# EasyEDA Pro project Tracer-1.1.epro

# Schematic Schematic1.1
Board Name: Tracer-1.0; Create Date: 2025-08-11; Page Name: P1; Project Name: Tracer; Schematic Name: Schematic1.0; Update Date: 2025-08-10; Company: EasyEDA.com; Page Size: A4; Version: V1.0
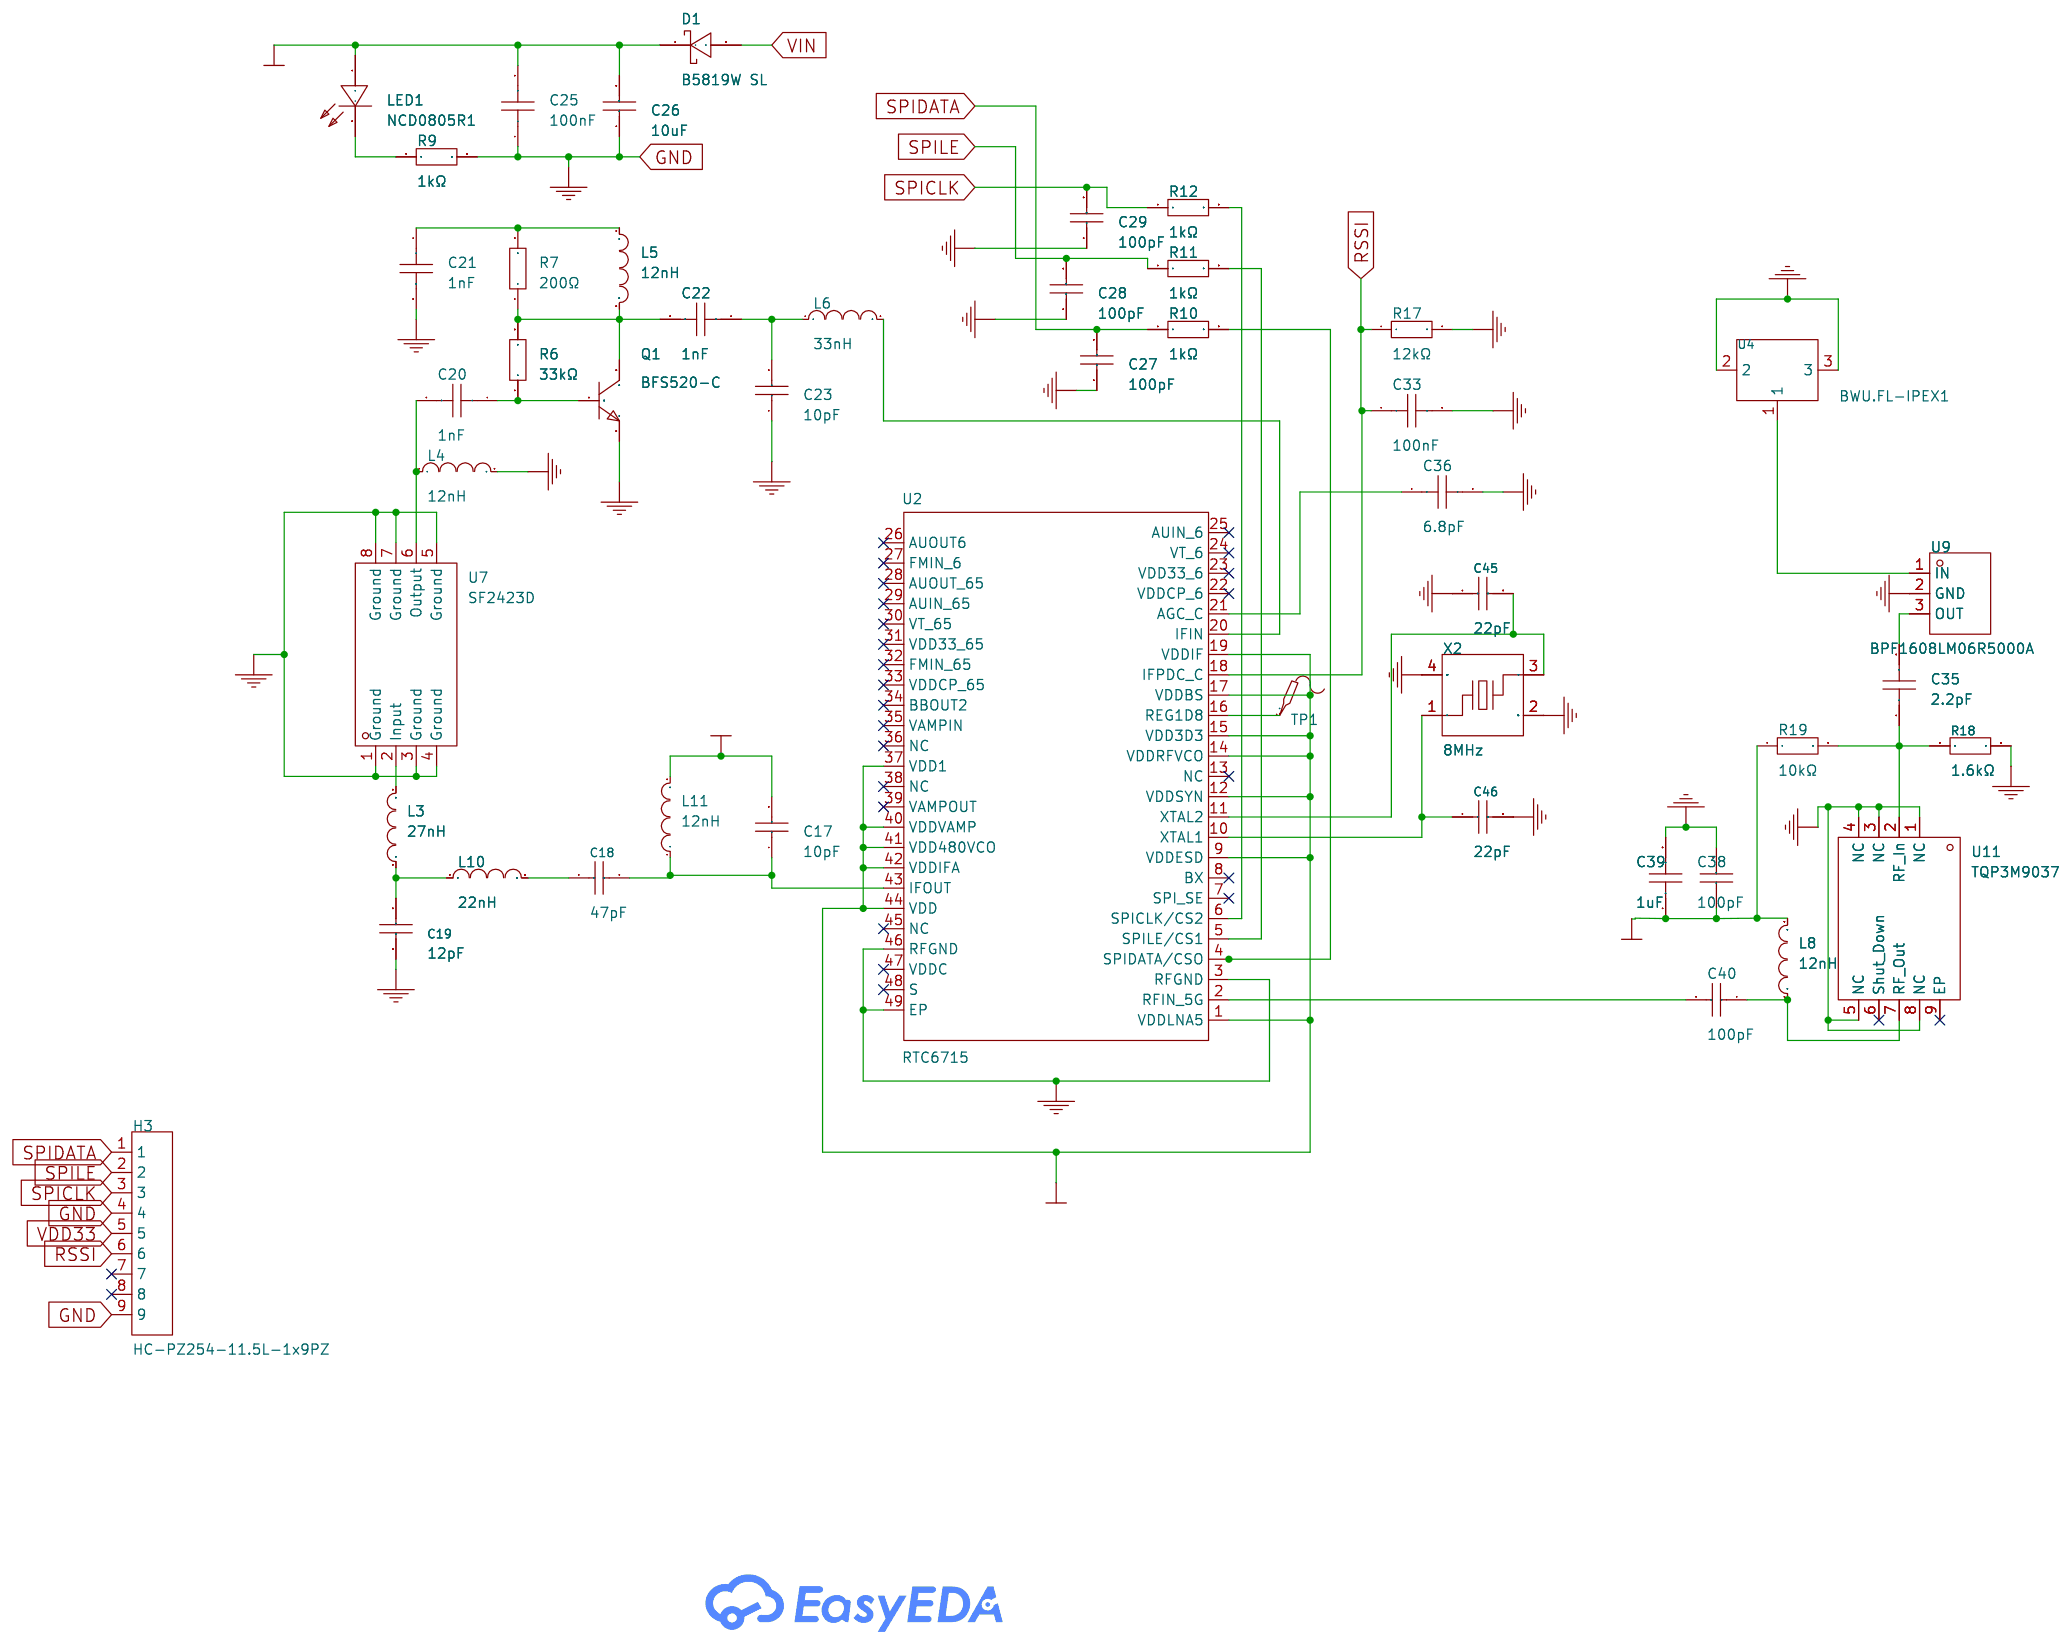
[diagram p0: schematic sheet]

## Parts
C17  10pF  [C0402]
C18  47pF  [C0402]
C19  12pF  [C0402]
C20  1nF  [C0402]
C21  1nF  [C0402]
C22  1nF  [C0402]
C23  10pF  [C0402]
C25  100nF  [C0402]
C26  10uF  [C0402]
C27  100pF  [C0402]
C28  100pF  [C0402]
C29  100pF  [C0402]
C33  100nF  [C0402]
C35  2.2pF  [C0402]
C36  6.8pF  [C0402]
C38  100pF  [C0402]
C39  1uF  [C0402]
C40  100pF  [C0402]
C45  22pF  [C0402]
C46  22pF  [C0402]
D1  B5819W SL  [SOD-123_L2.7-W1.6-LS3.7-RD-1]  (no BOM)
H3  HC-PZ254-11.5L-1x9PZ  [HDR-TH_9P-P2.54-V-M]
L3  27nH  [L0402-RD]
L4  12nH  [L0402]
L5  12nH  [L0402]
L6  33nH  [L0402]
L8  12nH  [L0402]
L10  22nH  [L0402]
L11  12nH  [L0402]
LED1  NCD0805R1  [LED0805-R-RD]
Q1  BFS520-C  [SOT-323-3_L2.0-W1.3-P1.30-LS2.3-BR]
R6  33kΩ  [R0402]
R7  200Ω  [R0402]
R9  1kΩ  [R0402]
R10  1kΩ  [R0402]
R11  1kΩ  [R0402]
R12  1kΩ  [R0402]
R17  12kΩ  [R0402]
R18  1.6kΩ  [R0402]
R19  10kΩ  [R0402]
TP1  -  [Test-Point-0.5mm]
U2  RTC6715  [QFN-48_L7.0-W7.0-P0.50-BL-EP5.6]
U4  BWU.FL-IPEX1  [IPEX-SMD_BWIPX-1-001E]
U7  SF2423D  [FILTER-SMD_8P-L3.8-W3.8-P1.27-BL]
U9  BPF1608LM06R5000A  [FILTER-SMD_3P-L1.6-W0.8-L]
U11  TQP3M9037  [DFN-8_L2.0-W2.0-P0.50-BL-EP]
X2  8MHz  [CRYSTAL-SMD_4P-L3.2-W2.5-BL]

## Library data of the parts
C17 = CC0402JRNPO9BN100: Capacitance: Tolerance:±5% Tolerance:±5% Voltage Rated: Temperature Coefficient:; LCSC Part Name: 10pF ±5% 50V; Supplier Part: C106199; Manufacturer: YAGEO(国巨); Supplier Footprint: 0402; JLCPCB Part Class: Extended Part; Datasheet: https://atta.szlcsc.com/upload/public/pdf/source/20181008/C309499_21CC21451B82C39E3D92150FD6B30293.pdf; Supplier: LCSC; Tolerance: ±5%
C18 = CC0402JRNPO9BN470: Capacitance: Tolerance:±5% Tolerance:±5% Voltage Rated: Temperature Coefficient:; LCSC Part Name: 47pF ±5% 50V; Supplier Part: C60137; Manufacturer: YAGEO(国巨); Supplier Footprint: 0402; JLCPCB Part Class: Extended Part; Datasheet: https://atta.szlcsc.com/upload/public/pdf/source/20170505/1493957838062.pdf; Supplier: LCSC; Tolerance: ±5%
C19 = GRM1555C1H120JA01D: Capacitance: Tolerance:±5% Tolerance:±5% Voltage Rated: Temperature Coefficient:; LCSC Part Name: 12pF ±5% 50V; Supplier Part: C76948; Manufacturer: muRata(村田); Supplier Footprint: 0402; JLCPCB Part Class: Extended Part; Datasheet: https://atta.szlcsc.com/upload/public/pdf/source/20180307/C76948_15204091175261407736.pdf; Supplier: LCSC; Tolerance: ±5%
C20-C22 = GRM155R71H102KA01D: Capacitance: Tolerance:±10% Tolerance:±10% Voltage Rated: Temperature Coefficient:; LCSC Part Name: 1nF ±10% 50V; Supplier Part: C77018; Manufacturer: muRata(村田); Supplier Footprint: 0402; JLCPCB Part Class: Extended Part; Datasheet: https://atta.szlcsc.com/upload/public/pdf/source/20180326/C77018_71D0653F0B6E6646EFFB4BBD1FDBEE7C.pdf; Supplier: LCSC; Tolerance: ±10%
C23 = GRM1555C1H100JA01D: Capacitance: Tolerance:±5% Tolerance:±5% Voltage Rated: Temperature Coefficient:; LCSC Part Name: 10pF ±5% 50V; Supplier Part: C76946; Manufacturer: muRata(村田); Supplier Footprint: 0402; JLCPCB Part Class: Extended Part; Datasheet: https://atta.szlcsc.com/upload/public/pdf/source/20180307/C76946_15204091154331407734.pdf; Supplier: LCSC; Tolerance: ±5%
C25 C33 = CL05B104KO5NNNC: Capacitance: Tolerance:±10% Tolerance:±10% Voltage Rated: Temperature Coefficient:; LCSC Part Name: 100nF ±10% 16V; Supplier Part: C1525; Manufacturer: SAMSUNG(三星); Supplier Footprint: 0402; JLCPCB Part Class: Basic Part; Datasheet: https://atta.szlcsc.com/upload/public/pdf/source/20160218/1457707763339.pdf; Supplier: LCSC; Tolerance: ±10%
C26 = GRM155R60J106ME44D: Capacitance: Tolerance:±20% Tolerance:±20% Voltage Rated: Temperature Coefficient:; LCSC Part Name: 10uF ±20% 6.3V; Supplier Part: C76991; Manufacturer: muRata(村田); Supplier Footprint: 0402; JLCPCB Part Class: Extended Part; Datasheet: https://atta.szlcsc.com/upload/public/pdf/source/20200305/C490387_23319AE8C154DEB24C505E6C82A8106A.pdf; Supplier: LCSC; Tolerance: ±20%
C27-C29 C38 C40 = GRM1555C1H101JA01D: Capacitance: Tolerance:±5% Tolerance:±5% Voltage Rated: Temperature Coefficient:; LCSC Part Name: 100pF ±5% 50V; Supplier Part: C77177; Manufacturer: muRata(村田); Supplier Footprint: 0402; JLCPCB Part Class: Extended Part; Datasheet: https://atta.szlcsc.com/upload/public/pdf/source/20161108/1478586482814.pdf; Supplier: LCSC; Tolerance: ±5%
C35 = GJM1555C1H2R2BB01D: Capacitance: Voltage Rating: Temperature Coefficient:; LCSC Part Name: ±0.1pF 2.2pF 50V; Supplier Part: C88886; Manufacturer: muRata(村田); Supplier Footprint: 0402; JLCPCB Part Class: Extended Part; Datasheet: https://atta.szlcsc.com/upload/public/pdf/source/20241220/D0AFAF126C1929700C0BCD7972400352.pdf; Supplier: LCSC
C36 = CC0402CRNPO9BN6R8: Capacitance: Voltage Rated: Temperature Coefficient:; LCSC Part Name: 6.8pF 50V ±0.25pF; Supplier Part: C189470; Manufacturer: YAGEO(国巨); Supplier Footprint: 0402; JLCPCB Part Class: Extended Part; Datasheet: https://atta.szlcsc.com/upload/public/pdf/source/20181008/C309499_21CC21451B82C39E3D92150FD6B30293.pdf; Supplier: LCSC
C39 = CL05A105KA5NQNC: Capacitance: Tolerance:±10% Tolerance:±10% Voltage Rated: Temperature Coefficient:; LCSC Part Name: 1uF ±10% 25V; Supplier Part: C52923; Manufacturer: SAMSUNG(三星); Supplier Footprint: 0402; JLCPCB Part Class: Basic Part; Datasheet: https://atta.szlcsc.com/upload/public/pdf/source/20160218/1457707763339.pdf; Supplier: LCSC; Tolerance: ±10%
C45 C46 = CC0402JRNPO9BN220: Capacitance: Tolerance:±5% Tolerance:±5% Voltage Rated: Temperature Coefficient:; LCSC Part Name: 22pF ±5% 50V; Supplier Part: C106203; Manufacturer: YAGEO(国巨); Supplier Footprint: 0402; JLCPCB Part Class: Extended Part; Datasheet: https://atta.szlcsc.com/upload/public/pdf/source/20170505/1493957838062.pdf; Supplier: LCSC; Tolerance: ±5%
D1 = B5819W SL: Forward Voltage (Vf@If):600mV@1A Reverse Voltage (Vr):40V Rectified Current:1A; LCSC Part Name: 电压:40V 电流:1A; Supplier Part: C8598; Manufacturer: CJ(江苏长电/长晶); Supplier Footprint: SOD-123; JLCPCB Part Class: Basic Part; Datasheet: https://atta.szlcsc.com/upload/public/pdf/source/20171228/C164911_15144413243851213914.pdf; Supplier: LCSC; Forward Voltage (Vf@If): 600mV@1A; Reverse Voltage (Vr): 40V; Rectified Current: 1A
H3 = HC-PZ254-11.5L-1x9PZ: Pin Structure:1x9P Pitch:2.54mm Row Spacing:- Circluar Pins/Square Pins:Policy Mounting Type:Straight Number of Rows:Single Row Number of Pins:9P Current Rating:3A Voltage Rating (Max):- Length of Mating Pin:6mm Insulation Height:2.5mm Length of End Conne; LCSC Part Name: 1x9P 间距:2.54mm 方针 直插; Supplier Part: C27985193; Manufacturer: HC(虹成电子); Supplier Footprint: 插件,P=2.54mm; JLCPCB Part Class: Extended Part; Datasheet: https://atta.szlcsc.com/upload/public/pdf/source/20250106/3C3F1947CD1C0315AE43406BAF0BB9D7.pdf; Supplier: LCSC; Pin Structure: 1x9P; Pitch: 2.54mm; Circluar Pins/Square Pins: Policy; Mounting Type: Straight; Number of Rows: Single Row; Number of Pins: 9P; Current Rating: 3A; Length of Mating Pin: 6mm; Insulation Height: 2.5mm; Length of End Connection Pin: 3mm; Contact Material: Brass; Contact Plating: Gold; Operating Temperature: -40℃~+105℃; Color: Black
L3 = LQG15HS27NJ02D: Inductance: Tolerance:±5% Tolerance:±5% Rated Current: Saturation Current (Isat):- DC Resistance (DCR): Q @ Freq:8@100MHz Frequency - Self Resonant: Ratings:; LCSC Part Name: 27nH ±5%; Supplier Part: C12669; Manufacturer: muRata(村田); Supplier Footprint: 0402; JLCPCB Part Class: Extended Part; Datasheet: https://atta.szlcsc.com/upload/public/pdf/source/20170810/C86059_1502335402466879997.pdf; Supplier: LCSC; Tolerance: ±5%; Q @ Freq: 8@100MHz
L4 L5 L8 L11 = LQW15AN12NG00D: Inductance: Tolerance:±2% Tolerance:±2% Rated Current: Saturation Current (Isat):- DC Resistance (DCR): Ratings:-; LCSC Part Name: 12nH ±2%; Supplier Part: C86128; Manufacturer: muRata(村田); Supplier Footprint: 0402; JLCPCB Part Class: Extended Part; Datasheet: https://atta.szlcsc.com/upload/public/pdf/source/20161104/1478253457680.pdf; Supplier: LCSC; Tolerance: ±2%
L6 = LQG15HS33NJ02D: Inductance: Tolerance:±5% Tolerance:±5% Rated Current: Saturation Current (Isat):- DC Resistance (DCR): Q @ Freq:8@100MHz Frequency - Self Resonant: Ratings:; LCSC Part Name: 33nH ±5%; Supplier Part: C86062; Manufacturer: muRata(村田); Supplier Footprint: 0402; JLCPCB Part Class: Extended Part; Datasheet: https://atta.szlcsc.com/upload/public/pdf/source/20180612/C185484_14F678484DDF036353DC67B6265A9221.pdf; Supplier: LCSC; Tolerance: ±5%; Q @ Freq: 8@100MHz
L10 = LQW15AN22NJ00D: Inductance: Tolerance:±5% Tolerance:±5% Rated Current: Saturation Current (Isat):- DC Resistance (DCR): Ratings:-; LCSC Part Name: 22nH ±5%; Supplier Part: C167470; Manufacturer: muRata(村田); Supplier Footprint: 0402; JLCPCB Part Class: Extended Part; Datasheet: https://atta.szlcsc.com/upload/public/pdf/source/20191016/C437364_463D6516B3BAE72B1DA0754F3D9B8308.pdf; Supplier: LCSC; Tolerance: ±5%
LED1 = NCD0805R1_C84256: Lamp Holder Type:- Emitted Color:Red Forward Voltage (VF):1.6V~2.6V Forward Voltage (VF):1.6V~2.6V Power Dissipation:65mW Forward Current:20mA Dominant Wavelength:615nm~630nm Dominant Wavelength:615nm~630nm Peak Wavelength:- Diode Configuration:独立二极管 Lens; Supplier Part: C84256; Manufacturer: 国星光电; Supplier Footprint: 0805; JLCPCB Part Class: Basic Part; Datasheet: https://atta.szlcsc.com/upload/public/pdf/source/20200820/C84256_F0A75A43B3EAD75808600A0514C76B99.pdf; Supplier: LCSC; Emitted Color: Red; Forward Voltage (VF): 1.6V~2.6V; Power Dissipation: 65mW; Forward Current: 20mA; Dominant Wavelength: 615nm~630nm; Diode Configuration: 独立二极管; Lens Color: 无色透明透镜; Luminous Intensity: 67mcd~195mcd; Viewing Angle: 130°; Operating Temperature: -30℃~+85℃
Q1 = BFS520-C: type:NPN Current - Collector(Ic): Collector - Emitter Voltage VCEO:12V Pd - Power Dissipation:150mW Transition frequency(fT):8GHz Current - Collector Cutoff:100nA Operating Temperature:150℃@(Tj) Operating Temperature:150℃@(Tj); Supplier Part: C7496541; Manufacturer: Slkor(萨科微); Supplier Footprint: SOT-323; JLCPCB Part Class: Extended Part; Datasheet: https://atta.szlcsc.com/upload/public/pdf/source/20230809/CB04839AF99A4F42C665D5FCB4C9F9C8.pdf; Supplier: LCSC; type: NPN; Collector - Emitter Voltage VCEO: 12V; Pd - Power Dissipation: 150mW; Transition frequency(fT): 8GHz; Current - Collector Cutoff: 100nA; Operating Temperature: 150℃@(Tj)
R6 = RC0402FR-0733KL: Type:Thick Film Resistors Resistance: Tolerance:±1% Tolerance:±1% Power(Watts): Overload Voltage (Max): Temperature Coefficient:±100ppm/℃ Temperature Coefficient:±100ppm/℃ Operating Temperature Range:-55℃~+155℃ Operating Temperature Range:-55℃~+155℃; LCSC Part Name: 厚膜电阻 33kΩ ±1% 62.5mW; Supplier Part: C138003; Manufacturer: YAGEO(国巨); Supplier Footprint: 0402; JLCPCB Part Class: Extended Part; Datasheet: https://atta.szlcsc.com/upload/public/pdf/source/20181009/C309620_DA5935B6E1D48212CB7A533FE518B3C2.pdf; Supplier: LCSC; Type: Thick Film Resistors; Tolerance: ±1%; Temperature Coefficient: ±100ppm/℃; Operating Temperature Range: -55℃~+155℃
R7 = RC0402FR-07200RL: Type:Thick Film Resistors Resistance: Tolerance:±1% Tolerance:±1% Power(Watts): Overload Voltage (Max): Temperature Coefficient:±100ppm/℃ Temperature Coefficient:±100ppm/℃ Operating Temperature Range:-55℃~+155℃ Operating Temperature Range:-55℃~+155℃; LCSC Part Name: 厚膜电阻 200Ω ±1% 62.5mW; Supplier Part: C114764; Manufacturer: YAGEO(国巨); Supplier Footprint: 0402; JLCPCB Part Class: Extended Part; Datasheet: https://atta.szlcsc.com/upload/public/pdf/source/20180821/C275644_0D56F95EFF785E7D9A1FEF436B37DA78.pdf; Supplier: LCSC; Type: Thick Film Resistors; Tolerance: ±1%; Temperature Coefficient: ±100ppm/℃; Operating Temperature Range: -55℃~+155℃
R9-R12 = RC0402FR-071KL: Type:Thick Film Resistors Resistance: Tolerance:±1% Tolerance:±1% Power(Watts): Overload Voltage (Max): Temperature Coefficient:±100ppm/℃ Temperature Coefficient:±100ppm/℃ Operating Temperature Range:-55℃~+155℃ Operating Temperature Range:-55℃~+155℃; LCSC Part Name: 厚膜电阻 1kΩ ±1% 62.5mW; Supplier Part: C106235; Manufacturer: YAGEO(国巨); Supplier Footprint: 0402; JLCPCB Part Class: Extended Part; Datasheet: https://atta.szlcsc.com/upload/public/pdf/source/20180927/C295883_E8D83085EA81BD7DE0B2B681138C15EE.pdf; Supplier: LCSC; Type: Thick Film Resistors; Tolerance: ±1%; Temperature Coefficient: ±100ppm/℃; Operating Temperature Range: -55℃~+155℃
R17 = RTT021202FTH: Type:Thick Film Resistors Resistance: Tolerance:±1% Tolerance:±1% Power(Watts): Overload Voltage (Max): Temperature Coefficient:±100ppm/℃ Temperature Coefficient:±100ppm/℃ Operating Temperature Range:-55℃~+155℃ Operating Temperature Range:-55℃~+155℃; LCSC Part Name: 厚膜电阻 12kΩ ±1% 62.5mW; Supplier Part: C102781; Manufacturer: RALEC(旺诠); Supplier Footprint: 0402; JLCPCB Part Class: Extended Part; Datasheet: https://atta.szlcsc.com/upload/public/pdf/source/20191219/C158410_884373A5B7E1BC76BF57BC45A946C093.pdf; Supplier: LCSC; Type: Thick Film Resistors; Tolerance: ±1%; Temperature Coefficient: ±100ppm/℃; Operating Temperature Range: -55℃~+155℃
R18 = 0402WGF1601TCE: Type:Thick Film Resistors Resistance:1.6kΩ Tolerance:±1% Tolerance:±1% Power(Watts): Overload Voltage (Max): Temperature Coefficient:±100ppm/℃ Temperature Coefficient:±100ppm/℃ Operating Temperature Range:-55℃~+155℃ Operating Temperature Range:-55℃~+155℃; LCSC Part Name: 1.6kΩ ±1% 62.5mW 厚膜电阻; Supplier Part: C4908; Manufacturer: UNI-ROYAL(厚声); Supplier Footprint: 0402; JLCPCB Part Class: Extended Part; Datasheet: https://atta.szlcsc.com/upload/public/pdf/source/20200306/C422600_1E6D84923E4A46A82E41ADD87F860B5C.pdf; Supplier: LCSC; Type: Thick Film Resistors; Tolerance: ±1%; Temperature Coefficient: ±100ppm/℃; Operating Temperature Range: -55℃~+155℃
R19 = 0402WGF1002TCE: Type:Thick Film Resistors Resistance:10kΩ Tolerance:±1% Tolerance:±1% Power(Watts): Overload Voltage (Max): Temperature Coefficient:±100ppm/℃ Temperature Coefficient:±100ppm/℃ Operating Temperature Range:-55℃~+155℃ Operating Temperature Range:-55℃~+155℃; LCSC Part Name: 10kΩ ±1% 62.5mW 厚膜电阻; Supplier Part: C25744; Manufacturer: UNI-ROYAL(厚声); Supplier Footprint: 0402; JLCPCB Part Class: Basic Part; Datasheet: https://atta.szlcsc.com/upload/public/pdf/source/20200306/C422600_1E6D84923E4A46A82E41ADD87F860B5C.pdf; Supplier: LCSC; Type: Thick Film Resistors; Tolerance: ±1%; Temperature Coefficient: ±100ppm/℃; Operating Temperature Range: -55℃~+155℃
TP1 = Test-Point: Test Point 测试点
U2 = RTC6715: Supplier: LCSC; Supplier Part: C9900054332; Manufacturer: null
U4 = BWU.FL-IPEX1: Connector Type:板端 Interface Type:内针 Number of Ports:1 Interface Diameter:2mm Interface Length/Height:1.25mm Frequency-Max:6GHz RF Series:IPEX Impedance:50Ω Style:- Contact Material:- Contact Plating:- Operating Temperature Range:- Operating Temperature Ra; LCSC Part Name: 内针 IPEX; Supplier Part: C5137195; Manufacturer: BAT WIRELESS(蝙蝠无线); Supplier Footprint: SMD; JLCPCB Part Class: Extended Part; Datasheet: https://atta.szlcsc.com/upload/public/pdf/source/20220815/058ABE525AAE400925F1A3839AB872AC.pdf; Supplier: LCSC; Connector Type: 板端; Interface Type: 内针; Number of Ports: 1; Interface Diameter: 2mm; Interface Length/Height: 1.25mm; Frequency-Max: 6GHz; RF Series: IPEX; Impedance: 50Ω
U7 = SF2423D: Center Frequency:- Passband bandwidth:- impedance:50Ω Insertion Loss:3dB Operating Temperature:-45℃~+125℃ Operating Temperature:-45℃~+125℃; LCSC Part Name: 480MHz SAW滤波器; Supplier Part: C3283607; Manufacturer: muRata(村田); Supplier Footprint: SMD3838-8P; JLCPCB Part Class: Extended Part; Datasheet: https://atta.szlcsc.com/upload/public/pdf/source/20240403/ED4256AC268FE5B1F2E5FF148E88C586.pdf; Supplier: LCSC; impedance: 50Ω; Insertion Loss: 3dB; Operating Temperature: -45℃~+125℃
U9 = BPF1608LM06R5000A: Bandwidth:800MHz Filter Type:Bandpass Insertion Loss:0.6dB; Supplier Part: C3001931; Manufacturer: YAGEO(国巨); Supplier Footprint: SMD-3P,0.8x1.6mm; JLCPCB Part Class: Extended Part; Datasheet: https://atta.szlcsc.com/upload/public/pdf/source/20220425/9E150C4CF382690E709E014C87D9C8D1.pdf; Supplier: LCSC; Bandwidth: 800MHz; Filter Type: Bandpass; Insertion Loss: 0.6dB
U11 = TQP3M9037: Applications:CDMA；W-CDMA；LTE；GSM Frequency Range:700MHz~6GHz Frequency Range:700MHz~6GHz Gain:20dB Noise Figure:0.4dB Supply Voltage:3V~5V Supply Voltage:3V~5V Operating Temperature:-40℃~+105℃ Operating Temperature:-40℃~+105℃; LCSC Part Name: 超低噪声、高线性度射频放大器; Supplier Part: C415712; Manufacturer: Qorvo; Supplier Footprint: DFN-8-EP(2x2); JLCPCB Part Class: Extended Part; Datasheet: https://atta.szlcsc.com/upload/public/pdf/source/20190828/C415712_9ECAD0DC66BF7616C132A1FCBBB587F6.pdf; Supplier: LCSC; Applications: CDMA；W-CDMA；LTE；GSM; Frequency Range: 700MHz~6GHz; Gain: 20dB; Noise Figure: 0.4dB; Supply Voltage: 3V~5V; Operating Temperature: -40℃~+105℃
X2 = K3A080001210: Type:Surface Mount Crystal Frequency:8MHz Normal temperature Frequency Tolerance:±10ppm Normal temperature Frequency Tolerance:±10ppm Load Capacitance:12pF Frequency Stability:±20ppm Frequency Stability:±20ppm Equivalent Series Resistance(ESR):250Ω Operat; LCSC Part Name: 8MHz ±10ppm 12pF; Supplier Part: C2835958; Manufacturer: KYX(凯越翔); Supplier Footprint: SMD3225-4P; JLCPCB Part Class: Extended Part; Datasheet: https://atta.szlcsc.com/upload/public/pdf/source/20210602/C2835958_20331C3D0A5F6476C6D80678539B4418.pdf; Supplier: LCSC; Type: Surface Mount Crystal; Normal temperature Frequency Tolerance: ±10ppm; Load Capacitance: 12pF; Frequency Stability: ±20ppm; Equivalent Series Resistance(ESR): 250Ω; Operating Temperature: -40℃~+85℃

## Nets
GND: C19.1 C21.2 C23.1 C25.1 C26.1 C27.1 C28.1 C29.1 C33.2 C36.2 C38.2 C39.2 C45.1 C46.2 H3.4 H3.9 L4.2 Q1.2(E) R9.2 R17.2 R18.2 U2.3(RFGND) U2.46(RFGND) U2.49(EP) U4.2 U4.3 U7.1(Ground) U7.3(Ground) U7.4(Ground) U7.5(Ground) U7.7(Ground) U7.8(Ground) U9.2(GND) U11.1(NC) U11.3(NC) U11.4(NC) U11.5(NC) U11.8(NC) X2.2(GND) X2.4(GND)
VDD33: C17.2 C25.2 C26.2 C38.1 C39.1 D1.1(-) H3.5 L11.2 LED1.1(+) R19.1 U2.1(VDDLNA5) U2.9(VDDESD) U2.12(VDDSYN) U2.14(VDDRFVCO) U2.15(VDD3D3) U2.17(VDDBS) U2.19(VDDIF) U2.37(VDD1) U2.40(VDDVAMP) U2.41(VDD480VCO) U2.42(VDDIFA) U2.44(VDD)
VIN: D1.2(+)
RSSI: C33.1 H3.6 R17.1 U2.18(IFPDC_C)
SPICLK: C29.2 H3.3 R12.1
SPIDATA: C27.2 H3.1 R10.1
SPILE: C28.2 H3.2 R11.1
$1N1492: C17.1 C18.2 L11.1 U2.43(IFOUT)
$1N1534: C20.2 L4.1 U7.6(Output)
$1N3531: L6.2 U2.20(IFIN)
$1N3717: R11.2 U2.5(SPILE/CS1)
$1N3776: R10.2 U2.4(SPIDATA/CSO)
$1N3875: C40.2 U2.2(RFIN_5G)
$1N5216: LED1.2(-) R9.1
$1N5887: C40.1 L8.1 U11.7(RF Out)
$1N6637: C18.1 L10.2
$1N6641: C19.2 L3.1 L10.1
$1N6670: L3.2 U7.2(Input)
$1N6939: C20.1 Q1.1(B) R6.1
$1N7016: C22.2 L5.2 Q1.3(C) R6.2 R7.1
$1N7149: C21.1 L5.1 R7.2
$1N7307: C22.1 C23.2 L6.1
$1N8977: C36.1 U2.21(AGC_C)
$1N14274: C46.1 U2.10(XTAL1) X2.1
$1N14323: C45.2 U2.11(XTAL2) X2.3
$1N22690: TP1.1 U2.16(REG1D8)
$1N30056: R12.2 U2.6(SPICLK/CS2)
$1N30164: U4.1 U9.1(IN)
$1N30171: C35.2 U9.3(OUT)
$1N31954: C35.1 R18.1 R19.2 U11.2(RF In)

Not connected (* = marked no-connect by the designer): H3 7* 8*; L8 2; U2 7(SPI_SE)* 8(BX)* 13(NC)* 22(VDDCP_6)* 23(VDD33_6)* 24(VT_6)* 25(AUIN_6)* 26(AUOUT6)* 27(FMIN_6)* 28(AUOUT_65)* 29(AUIN_65)* 30(VT_65)* 31(VDD33_65)* 32(FMIN_65)* 33(VDDCP_65)* 34(BBOUT2)* 35(VAMPIN)* 36(NC)* 38(NC)* 39(VAMPOUT)* 45(NC)* 47(VDDC)* 48(S)*; U11 6(Shut Down)* 9(EP)*

# Board PCB1.1
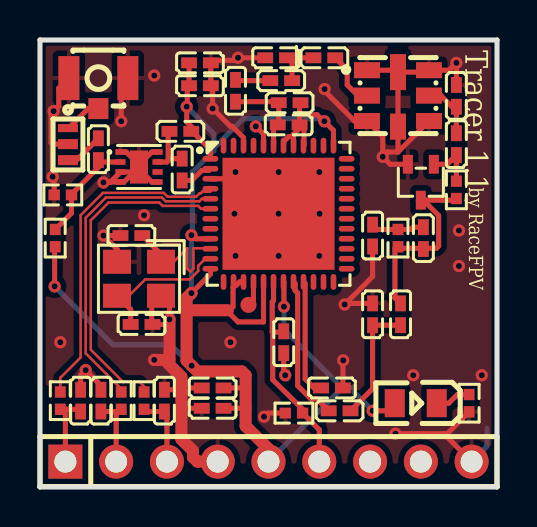
[diagram p1: board, top side]
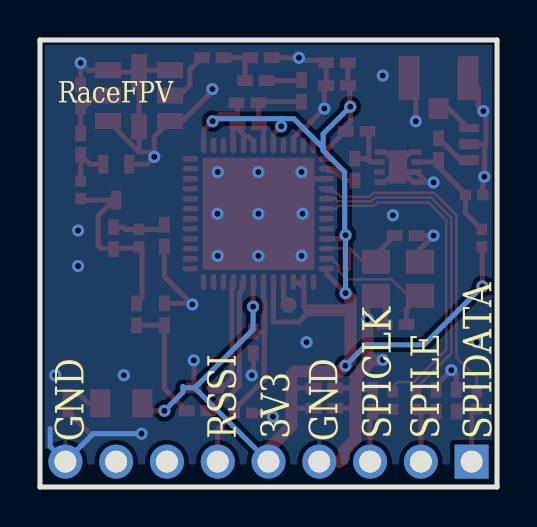
[diagram p2: board, bottom side, seen from below]

Outline 22.86 x 22.35 mm; copper layers: Top Layer, Bottom Layer. Coordinates in mm from the lower left corner of the outline.
Outline path: 0,22.35 22.86,22.35 22.86,0 0,0 0,22.35
Stack: Top Layer 0.035mm / Dielectric1 1.51mm FR4 er 4.5 / Bottom Layer 0.035mm

## Design rules (mm)
template: JLCPCB Capability(Two Layers Board)
spacing copperThickness1oz (default): track to track 0.102, other pairs 0.152 to 0.3
spacing copperThickness2oz: track to track 0.203, other pairs 0.152 to 0.3
track width copperThickness1oz (default): min 0.127, default 0.254, max 2.54
track width copperThickness2oz: min 0.203, default 0.254, max 2.54
differential pair differentialPair (default): width min 0.127, default 0.254, max 2.54; gap min 0.152, default 0.152
via viaSize (default): diameter min 0.5, default 0.61, max 10; hole min 0.3, default 0.305, max 6.3

## Placement (name value [footprint] x y rotation side)
C17  10pF  [C0402]  12.44 18.11 0 top
C18  47pF  [C0402]  9.78 19.81 270 top
C19  12pF  [C0402]  11.81 21.46 0 top
C20  1nF  [C0402]  20.83 17.14 90 top
C21  1nF  [C0402]  16.64 12.57 270 top
C22  1nF  [C0402]  18.03 8.64 90 top
C23  10pF  [C0402]  16.64 8.64 270 top
C25  100nF  [C0402]  8.64 4.95 0 top
C26  10uF  [C0402]  8.64 3.94 0 top
C27  100pF  [C0402]  2.03 4.32 270 top
C28  100pF  [C0402]  3.05 4.32 270 top
C29  100pF  [C0402]  6.22 4.32 270 top
C33  100nF  [C0402]  12.19 7.24 270 top
C35  2.2pF  [C0402]  2.92 16.89 90 top
C36  6.8pF  [C0402]  14.6 4.95 0 top
C38  100pF  [C0402]  8 20.07 0 top
C39  1uF  [C0402]  8 21.21 0 top
C40  100pF  [C0402]  7.11 15.88 270 top
C45  22pF  [C0402]  5.08 8.13 180 top
C46  22pF  [C0402]  4.57 12.57 180 top
H3  HC-PZ254-11.5L-1x9PZ  [HDR-TH_9P-P2.54-V-M]  11.43 1.27 0 top
L3  27nH  [L0402-RD]  14.22 21.46 0 top
L4  12nH  [L0402]  20.83 19.56 90 top
L5  12nH  [L0402]  19.18 12.45 270 top
L6  33nH  [L0402]  14.99 3.81 180 top
L8  12nH  [L0402]  7.02 17.78 0 top
L10  22nH  [L0402]  12.06 20.32 180 top
L11  12nH  [L0402]  12.49 19.21 0 top
LED1  NCD0805R1  [LED0805-R-RD]  18.8 4.19 180 top
Q1  BFS520-C  [SOT-323-3_L2.0-W1.3-P1.30-LS2.3-BR]  19.05 15.24 90 top
R6  33kΩ  [R0402]  20.83 14.86 270 top
R7  200Ω  [R0402]  17.91 12.45 90 top
R9  1kΩ  [R0402]  21.46 4.19 270 top
R10  1kΩ  [R0402]  1.02 4.32 90 top
R11  1kΩ  [R0402]  4.06 4.32 90 top
R12  1kΩ  [R0402]  5.21 4.32 90 top
R17  12kΩ  [R0402]  12.7 3.7 180 top
R18  1.6kΩ  [R0402]  1.14 14.61 180 top
R19  10kΩ  [R0402]  0.76 12.45 90 top
TP1  -  [Test-Point-0.5mm]  10.43 9.11 0 top
U2  RTC6715  [QFN-48_L7.0-W7.0-P0.50-BL-EP5.6]  11.93 13.66 270 top
U4  BWU.FL-IPEX1  [IPEX-SMD_BWIPX-1-001E]  2.92 19.69 90 top
U7  SF2423D  [FILTER-SMD_8P-L3.8-W3.8-P1.27-BL]  17.91 19.43 270 top
U9  BPF1608LM06R5000A  [FILTER-SMD_3P-L1.6-W0.8-L]  1.4 17.14 270 top
U11  TQP3M9037  [DFN-8_L2.0-W2.0-P0.50-BL-EP]  4.95 16 270 top
X2  8MHz  [CRYSTAL-SMD_4P-L3.2-W2.5-BL]  4.95 10.41 180 top

## Footprints (pads in the part's own frame, mm; a bottom-side part is the same pattern mirrored in y, then rotated)
C0402
  rect 0.79x0.54 smd: 1(-0.545,0) 2(0.545,0)
CRYSTAL-SMD_4P-L3.2-W2.5-BL
  rect 1.4x1.2 smd: 1(-1.1,-0.85) 2(1.1,-0.85) 3(1.1,0.85) 4(-1.1,0.85)
DFN-8_L2.0-W2.0-P0.50-BL-EP
  rect 0.28x0.505 smd: 1(-0.75,-0.927) 2(-0.25,-0.927) 3(0.25,-0.927) 4(0.75,-0.927) 5(0.75,0.927) 6(0.25,0.927) 7(-0.25,0.927) 8(-0.75,0.927)
  rect 1.65x0.9 smd: 9(0,0)
FILTER-SMD_3P-L1.6-W0.8-L
  rect 0.4x1 smd: 1(-0.8,0)
  rect 0.5x1 smd: 2(0,0) 3(0.8,0)
FILTER-SMD_8P-L3.8-W3.8-P1.27-BL
  rect 0.8x1.3 smd: 1(-1.41,-1.55) 2(-0.14,-1.55) 3(1.13,-1.55) 5(1.13,1.55) 6(-0.14,1.55) 7(-1.41,1.55)
  rect 1.3x0.8 smd: 4(1.41,0)
  rect 1.8x0.8 smd: 8(-1.315,0)
HDR-TH_9P-P2.54-V-M
  rect 1.7x1.7 hole 1.1: 1(-10.16,0)
  round 1.7 hole 1.1: 2(-7.62,0) 3(-5.08,0) 4(-2.54,0) 5(0,0) 6(2.54,0) 7(5.08,0) 8(7.62,0) 9(10.16,0)
IPEX-SMD_BWIPX-1-001E
  rect 1.05x1 smd: 1(-0.762,0)
  rect 2.2x1.05 smd: 2(0.762,-1.475) 3(0.762,1.475)
L0402
  rect 0.79x0.54 smd: 1(-0.545,0) 2(0.545,0)
L0402-RD
  rect 0.79x0.54 smd: 1(-0.545,0) 2(0.545,0)
LED0805-R-RD
  rect 1x1.399 smd: 1(1.05,0) 2(-1.05,0)
QFN-48_L7.0-W7.0-P0.50-BL-EP5.6
  oval 0.28x0.79 smd: 1(-2.75,-3.408) 2(-2.25,-3.408) 3(-1.75,-3.408) 4(-1.25,-3.408) 5(-0.75,-3.408) 6(-0.25,-3.408) 7(0.25,-3.408) 8(0.75,-3.408) 9(1.25,-3.408) 10(1.75,-3.408) 11(2.25,-3.408) 12(2.75,-3.408) 25(2.75,3.408) 26(2.25,3.408) 27(1.75,3.408) 28(1.25,3.408) 29(0.75,3.408) 30(0.25,3.408) 31(-0.25,3.408) 32(-0.75,3.408) 33(-1.25,3.408) 34(-1.75,3.408) 35(-2.25,3.408) 36(-2.75,3.408)
  oval 0.79x0.28 smd: 13(3.408,-2.75) 14(3.408,-2.25) 15(3.408,-1.75) 16(3.408,-1.25) 17(3.408,-0.75) 18(3.408,-0.25) 19(3.408,0.25) 20(3.408,0.75) 21(3.408,1.25) 22(3.408,1.75) 23(3.408,2.25) 24(3.408,2.75) 37(-3.408,2.75) 38(-3.408,2.25) 39(-3.408,1.75) 40(-3.408,1.25) 41(-3.408,0.75) 42(-3.408,0.25) 43(-3.408,-0.25) 44(-3.408,-0.75) 45(-3.408,-1.25) 46(-3.408,-1.75) 47(-3.408,-2.25) 48(-3.408,-2.75)
  rect 5.6x5.6 smd: 49(0,0)
R0402
  rect 0.566x0.54 smd: 1(-0.433,0) 2(0.433,0)
SOT-323-3_L2.0-W1.3-P1.30-LS2.3-BR
  rect 0.936x0.5 smd: 1(0.898,-0.65) 2(0.898,0.65) 3(-0.898,0)
Test-Point-0.5mm
  round 0.8 smd: 1(0,0)

## Nets
As in the schematic, except:
GND: C19.1 C21.2 C23.1 C25.1 C26.1 C27.1 C28.1 C29.1 C33.2 C36.2 C38.2 C39.2 C45.1 C46.2 H3.4 H3.9 L4.2 Q1.2 R9.2 R17.2 R18.2 U2.3 U2.46 U2.49 U4.2 U4.3 U7.1 U7.3 U7.4 U7.5 U7.7 U7.8 U9.2 U11.1 U11.3 U11.4 U11.5 U11.8 U11.9 X2.2 X2.4
VDD33: C17.2 C25.2 C26.2 C38.1 C39.1 H3.5 L8.2 L11.2 LED1.1 R19.1 U2.1 U2.9 U2.12 U2.14 U2.15 U2.17 U2.19 U2.37 U2.40 U2.41 U2.42 U2.44

Pads without a net: H3 7 8; U2 7 8 13 22 23 24 25 26 27 28 29 30 31 32 33 34 35 36 38 39 45 47 48; U11 6

## Via types
v1: diameter 0.61, hole 0.305, Top Layer to Bottom Layer, 44 vias

## Routing (per net, layer and track width the routed paths; a pad name or vN(x,y) marks a point on that pad's centre or on a via; arc(x,y) is an arc through that point)
GND: length 90.6
  Top Layer w0.254: 0.62,17.14 0.56,17.21 0.56,18.67 v1(0.68,18.8) 0.94,19.05 0.94,19.94 U4.3 ; 0.62,17.14 0.62,15.98 0.63,15.96 v1(0.63,15.51) 0.71,15.44 0.71,14.73 ; 0.62,17.14 U9.2 ; v1(17.15,16.51) 17.52,16.14 Q1.2 ; v1(17.15,16.51) 17.15,17.51 U7.3 15.74,18.3 14.24,19.8 v1(14.24,19.9) ; v1(17.15,16.51) 17.39,16.75 17.91,16.75 ; U2.46 10.18,17.47 9.62,18.03 9.53,18.03 v1(8.64,18.92) 8.64,20.23 8.55,20.32 8.55,21.34 9.78,21.34 v1(9.91,21.46) 11.52,21.46 ; 4.7,15.75 U11.3 3.53,15.25 ; 4.7,15.75 4.2,15.25 U11.4 3.53,15.25 ; 4.7,15.75 U11.9 ; 7.08,3.95 7.09,3.94 C26.1 ; 15.29,9.18 v1(15.24,9.13) ; 15.29,9.18 16.64,10.52 C21.2 ; 15.29,9.18 C23.1 ; U7.8 U7.4 17.91,16.75 ; U7.8 19.36,20.75 19.46,20.84 20.46,20.84 v1(20.83,21.21) L4.2 ; U7.8 17.81,20.84 U7.1 ; C36.2 15.15,6.31 v1(15.17,6.33) ; 20.19,2.67 20.37,2.67 R9.2 ; 20.19,2.67 v1(17.78,2.67) ; 20.19,2.67 H3.9 ; 4.95,16.11 4.31,16.75 U11.1 ; 4.95,16.11 5.59,16.75 U11.8 ; 4.95,16.11 U11.9 ; C46.2 v1(3.18,12.57) 3.85,11.89 X2.2 ; R17.2 11.39,3.7 v1(11.21,3.51) ; U2.3 10.18,15.41 v1(11.93,13.66) ; C28.1 3.05,5.08 v1(2.29,5.84) 2.03,5.59 C27.1 ; C33.2 12.19,5.66 v1(12.26,5.59) ; U11.9 4.95,15.89 5.61,15.24 5.87,15.24 U11.5 ; C29.1 7.01,4.86 7.1,4.95 C25.1 ; 17.91,16.75 19.46,18.3 ; U4.2 4.24,20.45 4.06,20.27 v1(4.06,18.29) ; 3.53,15.25 3.5,15.23 v1(3.18,15.23) 3.2,15.25 3.53,15.25 ; 5.59,9.1 X2.4 6.48,9.14 v1(6.48,8.38) 6.22,8.13 C45.1 5.59,8.09 5.59,9.1
  Top Layer w0.6: H3.4 7.87,1.27 7.65,1.49 7.65,1.81 7.08,2.39 7.08,5.51 6.23,6.36 ; v1(6.48,8.38) 6.48,6.36 6.23,6.36 ; v1(5.72,6.36) 6.23,6.36
  Bottom Layer w0.254: v1(17.78,2.67) 20.19,2.67 H3.9 22.35,2.03 22.35,2.92
  vias: v1(1.02,7.24) v1(5.21,13.59) v1(5.72,20.57) v1(9.53,7.24) v1(9.73,13.66) v1(9.78,15.75) v1(9.78,11.56) v1(11.94,15.75) v1(11.94,11.56) v1(13.97,15.75) v1(13.98,13.66) v1(13.97,11.56) v1(18.67,5.59) v1(20.96,12.83) v1(20.96,11.05) v1(22.1,5.59)
VDD33: length 80.3
  Top Layer w0.254: v1(10.8,18.03) 11.18,17.65 11.18,17.07 ; 12.98,18.62 13.86,18.62 14.22,18.25 14.26,18.25 ; 12.98,18.62 C17.2 ; 12.98,18.62 12.98,19.12 ; 14.26,18.25 14.68,17.83 U2.37 ; 14.26,18.25 v1(14.22,18.29) ; C17.2 13.21,17.88 13.21,17.1 U2.40 ; C17.2 12.98,17.94 12.68,17.63 ; C39.1 C38.1 7.37,19.98 7.37,18.99 v1(7.34,19.02) 7.34,18.25 7.75,17.85 7.75,17.65 8.52,16.87 U2.1 ; v1(16.64,3.81) 17.36,3.81 LED1.1 ; U2.15 9.99,10.26 9.82,10.09 ; 10.29,3.98 10.25,3.94 C26.2 ; U2.14 9.68,10.23 9.79,10.12 9.66,9.99 9.66,9.02 9.47,8.84 ; U2.19 12.2,10.23 v1(12.2,9.02) ; U2.42 12.18,17.26 12.45,17.53 12.57,17.53 12.68,17.63 ; 9.36,8.8 9.91,8.25 11.18,8.25 U2.17 ; 12.68,17.63 U2.41 ; v1(7.57,12.59) 7.68,12.49 7.72,12.49 7.79,12.41 U2.9 ; v1(0.73,10.03) 0.73,12.11 0.76,12.14 ; 10.03,4.95 C25.2 ; U2.12 8.52,10.64 v1(7.57,9.69)
  Top Layer w0.6: 7.56,8.84 9.4,8.84 ; v1(7.57,9.69) 7.33,9.45 7.33,6.32 v1(7.59,6.06) 7.87,5.78 10.1,5.78 10.29,5.59 10.29,3.05 11.43,1.91 H3.5
  Bottom Layer w0.254: 15.12,4.96 15.65,4.96 15.71,5.02 15.71,4.74 v1(16.64,3.81) ; 15.12,4.96 H3.5 ; 15.12,4.96 12.2,7.87 v1(12.2,9.02) ; v1(0.73,10.03) 3.65,7.11 6.54,7.11 v1(7.59,6.06) ; 8.7,16.95 10.16,18.42 10.8,18.42 ; 8.7,16.95 8.7,16.83 7.62,15.75 7.62,12.64 v1(7.57,12.59) v1(7.57,9.69) ; 8.7,16.95 8.7,17.66 v1(7.34,19.02) ; v1(10.8,18.03) 10.8,18.42 ; 10.8,18.42 14.1,18.42 v1(14.22,18.29)
RSSI: length 10.6
  Top Layer w0.254: 11.62,7.74 12.15,7.74 C33.1 ; 11.62,7.74 11.64,7.71 11.64,5.36 13.13,3.89 13.13,3.7 13.97,2.86 H3.6 ; 11.62,7.74 11.62,9.26 11.68,9.32 U2.18
SPICLK: length 3.6
  Top Layer w0.254: R12.1 5.32,3.77 C29.2 6.35,3.65 H3.3
SPIDATA: length 3.7
  Top Layer w0.254: R10.1 1.31,3.89 ; 1.31,3.89 1.27,3.84 H3.1 ; 1.31,3.89 1.92,3.89 C27.2
SPILE: length 3.6
  Top Layer w0.254: 3.95,3.77 3.81,3.63 H3.2 ; 3.95,3.77 C28.2 ; 3.95,3.77 R11.1
$1N1492: length 4.4
  Top Layer w0.254: U2.43 11.68,17.07 11.68,17.9 C17.1 11.94,18.16 L11.1 11.89,19.27 C18.2
$1N1534: length 2.9
  Top Layer w0.254: 19.46,19.57 20.05,19.57 20.61,19.01 L4.1 C20.2
$1N3531: length 7.3
  Top Layer w0.254: L6.2 13.85,4.4 13.55,4.4 12.89,5.06 12.89,9.7 12.76,9.83 12.76,10.17 U2.20
$1N3717: length 16.2
  Top Layer w0.127: U2.5 8.1,14.41 7.97,14.29 6.29,14.29 6.1,14.48 3.3,14.48 2.29,13.46 2.29,6.68 4.06,4.91 R11.2
$1N3776: length 16.5
  Top Layer w0.127: R10.2 1.02,5.46 2.03,6.48 2.03,13.59 3.15,14.71 6.19,14.71 6.38,14.52 7.81,14.52 7.99,14.69 8.04,14.69 8.12,14.77 8.51,14.77 8.52,14.79 U2.4
$1N3875: length 1.7
  Top Layer w0.254: C40.2 7.59,15.33 8.09,15.83 8.44,15.83 U2.2
$1N5216: length 1.8
  Top Layer w0.254: LED1.2 20.45,4.19 20.88,4.62 R9.1
$1N5887: length 2.7
  Top Layer w0.254: C40.1 6.51,16.42 ; U11.7 6.35,16.25 6.41,16.32 6.41,17.72 L8.1
$1N6637: length 1.8
  Top Layer w0.254: L10.2 9.82,20.32 C18.1
$1N6641: length 2.8
  Top Layer w0.254: L10.1 12.61,21.21 C19.2 L3.1 13.81,21.34
$1N6670: length 2.6
  Top Layer w0.254: U7.2 15.9,19.57 15.37,20.1 15.37,20.86 14.9,21.34
$1N6939: length 2.6
  Top Layer w0.254: R6.1 20.83,16.34 20.57,16.34 ; C20.1 20.57,16.34 ; 20.57,16.34 20.37,16.14 Q1.1
$1N7016: length 9.6
  Top Layer w0.254: C22.2 17.76,9.46 17.76,11.91 ; 19.3,14.34 20.74,14.34 R6.2 ; 19.3,14.34 18.92,14.34 ; 19.3,14.34 19.3,14.22 19.94,13.58 19.94,12.05 19.83,11.94 17.76,11.94
$1N7149: length 2.7
  Top Layer w0.254: C21.1 16.88,12.88 18.56,12.88 18.67,12.99 L5.1
$1N7307: length 6.1
  Top Layer w0.254: 15.53,3.81 16.64,4.92 C23.2 C22.1
$1N8977: length 5.9
  Top Layer w0.254: U2.21 13.26,10.17 13.26,5.41 13.72,4.95 C36.1
$1N14274: length 6.9
  Top Layer w0.127: X2.1 6.05,11.14 6.16,11.03 6.46,11.03 7.37,11.94 7.37,10.92 7.52,10.77 7.67,10.92 7.67,11.94 8.5,11.94 U2.10
  Top Layer w0.254: X2.1 6.05,11.64 C46.1
$1N14323: length 7.3
  Top Layer w0.127: X2.3 4.45,9.56 5.26,10.38 7.49,10.38 7.91,10.8 7.91,11.06 8.27,11.41 U2.11
  Top Layer w0.254: X2.3 4.53,8.88 C45.2
$1N22690: length 1.3
  Top Layer w0.254: TP1.1 10.68,9.36 10.68,10.25 U2.16
$1N30056: length 16.8
  Top Layer w0.127: R12.2 5.34,4.89 4.98,5.25 4.16,5.25 2.54,6.87 2.54,13.33 3.43,14.22 5.97,14.22 6.14,14.06 7.91,14.06 8.06,13.91 U2.6
$1N30164: length 2.2
  Top Layer w0.254: 1.14,17.94 1.44,17.94 2.41,18.92 U4.1
$1N30171: length 2
  Top Layer w0.254: C35.2 1.83,16.34 U9.3
$1N31954: length 5.4
  Top Layer w0.254: U11.2 2.92,16.25 2.92,15.99 1.58,14.64 R18.1 1.58,13.69 R19.2

## Copper pours and planes (outline as drawn; the poured copper is in the pictures)
GND on Top Layer: -1.91,22.48 24.51,22.48 24.51,1.14 -1.91,1.14
GND on Bottom Layer: -2.54,23.88 24.51,23.88 24.51,1.14 -2.54,1.14

## Text on the board
Bottom Silkscreen Layer: RaceFPV | SPIDATA | SPILE | SPICLK | GND | 3V3 | RSSI
Top Silkscreen Layer: by RaceFPV | Tracer 1.1
